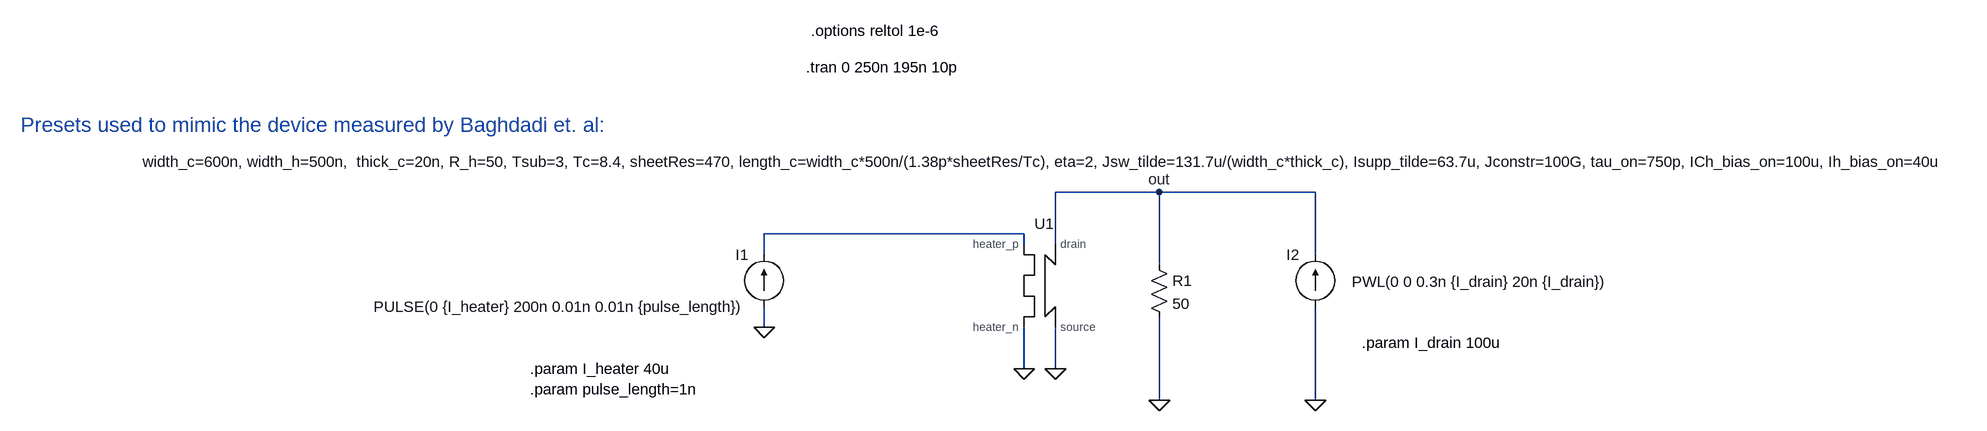
[diagram p0: schematic test_circuit_pulse.asc]
test_circuit_pulse.asc, the LTspice schematic file:
Version 4
SHEET 1 1964 1228
WIRE 336 32 176 32
WIRE 576 32 336 32
WIRE 128 96 -272 96
WIRE 128 112 128 96
WIRE 176 112 176 32
WIRE -272 128 -272 96
WIRE 576 128 576 32
WIRE 336 144 336 32
WIRE -272 240 -272 208
WIRE 128 304 128 240
WIRE 176 304 176 240
WIRE 336 352 336 224
WIRE 576 352 576 208
FLAG -272 240 0
FLAG 176 304 0
FLAG 576 352 0
FLAG 336 32 out
FLAG 128 304 0
FLAG 336 352 0
SYMBOL current -272 208 R180
WINDOW 0 24 80 Left 2
WINDOW 3 24 0 Left 2
WINDOW 123 0 0 Left 0
WINDOW 39 0 0 Left 0
SYMATTR InstName I1
SYMATTR Value PULSE(0 {I_heater} 200n 0.01n 0.01n {pulse_length})
SYMBOL current 576 208 R180
WINDOW 0 24 80 Left 2
WINDOW 3 -455 38 Left 2
WINDOW 123 0 0 Left 0
WINDOW 39 0 0 Left 0
SYMATTR InstName I2
SYMATTR Value PWL(0 0 0.3n {I_drain} 20n {I_drain})
SYMBOL res 320 128 R0
SYMATTR InstName R1
SYMATTR Value 50
SYMBOL hTron_behavioral 192 176 R0
WINDOW 39 -17 -175 Bottom 2
SYMATTR InstName U1
SYMATTR SpiceLine width_c=600n, width_h=500n,  thick_c=20n, R_h=50, Tsub=3, Tc=8.4, sheetRes=470, length_c=width_c*500n/(1.38p*sheetRes/Tc), eta=2, Jsw_tilde=131.7u/(width_c*thick_c), Isupp_tilde=63.7u, Jconstr=100G, tau_on=750p, ICh_bias_on=100u, Ih_bias_on=40u
TEXT 648 264 Left 2 !.param I_drain 100u
TEXT -208 -160 Left 2 !.tran 0 250n 195n 10p
TEXT -632 304 Left 2 !.param I_heater 40u\n.param pulse_length=1n
TEXT -200 -216 Left 2 !.options reltol 1e-6
TEXT -1416 -72 Left 3 ;Presets used to mimic the device measured by Baghdadi et. al:

The netlist it stands for:
* test_circuit_pulse.asc
I1 0 N001 PULSE(0 {I_heater} 200n 0.01n 0.01n {pulse_length})
I2 0 out PWL(0 0 0.3n {I_drain} 20n {I_drain})
R1 out 0 50
XU1 N001 0 out 0 hTron_behav width_c=600n, width_h=500n,  thick_c=20n, R_h=50, Tsub=3, Tc=8.4, sheetRes=470, length_c=width_c*500n/(1.38p*sheetRes/Tc), eta=2, Jsw_tilde=131.7u/(width_c*thick_c), Isupp_tilde=63.7u, Jconstr=100G, tau_on=750p, ICh_bias_on=100u, Ih_bias_on=40u  ; pins heater_p heater_n drain source
.param I_drain 100u
.tran 0 250n 195n 10p
.param I_heater 40u
.param pulse_length=1n
.options reltol 1e-6
* Presets used to mimic the device measured by Baghdadi et. al:
.lib hTron_behavioral.lib
.backanno
.end

* Results of the author's LTspice run, read from the files saved beside the schematic
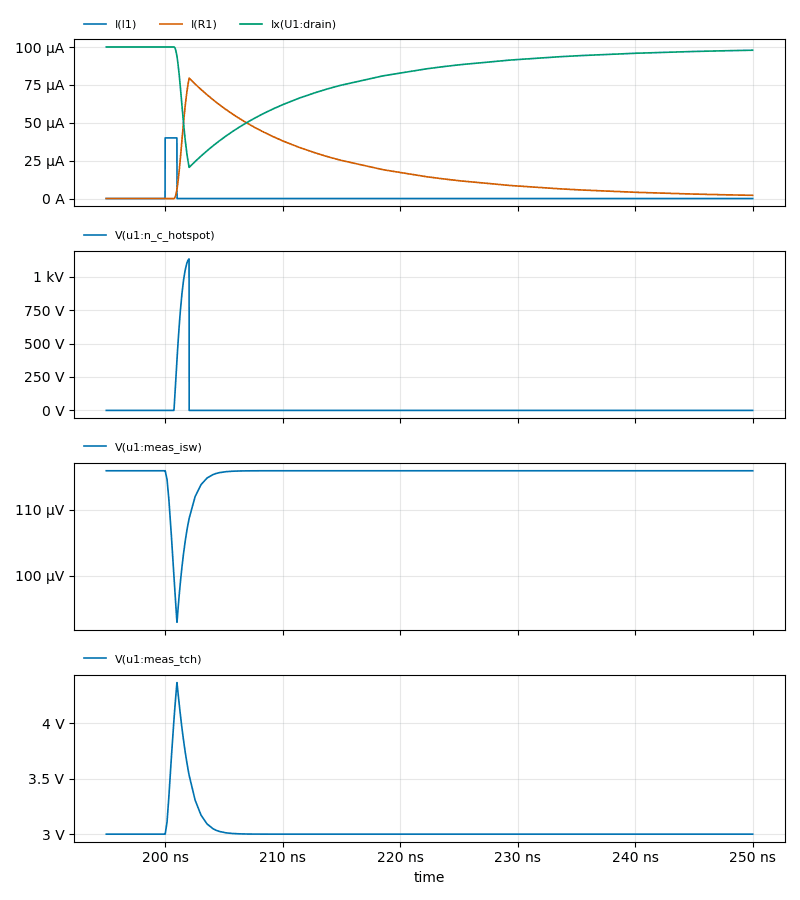
[diagram p1: Transient Analysis of test_circuit_pulse.asc, plotted from the saved traces]
* Transient Analysis, 1 run:
*   I(I1): min 0 A, max 40 µA, average 734.6 nA, rms 5.414 µA, last 0 A
*   I(R1): min 115 pA, max 79.44 µA, average 17.5 µA, rms 26.2 µA, last 2.109 µA
*   Ix(U1:drain): min 20.56 µA, max 100 µA, average 82.5 µA, rms 84.77 µA, last 97.89 µA
*   V(u1:n_c_hotspot): min 0 V, max 1.133 kV, average 17.41 V, rms 125.2 V, last 0 V
*   V(u1:meas_isw): min 92.98 µV, max 115.9 µV, average 115.3 µV, rms 115.4 µV, last 115.9 µV
*   V(u1:meas_tch): min 3 V, max 4.368 V, average 3.038 V, rms 3.042 V, last 3 V